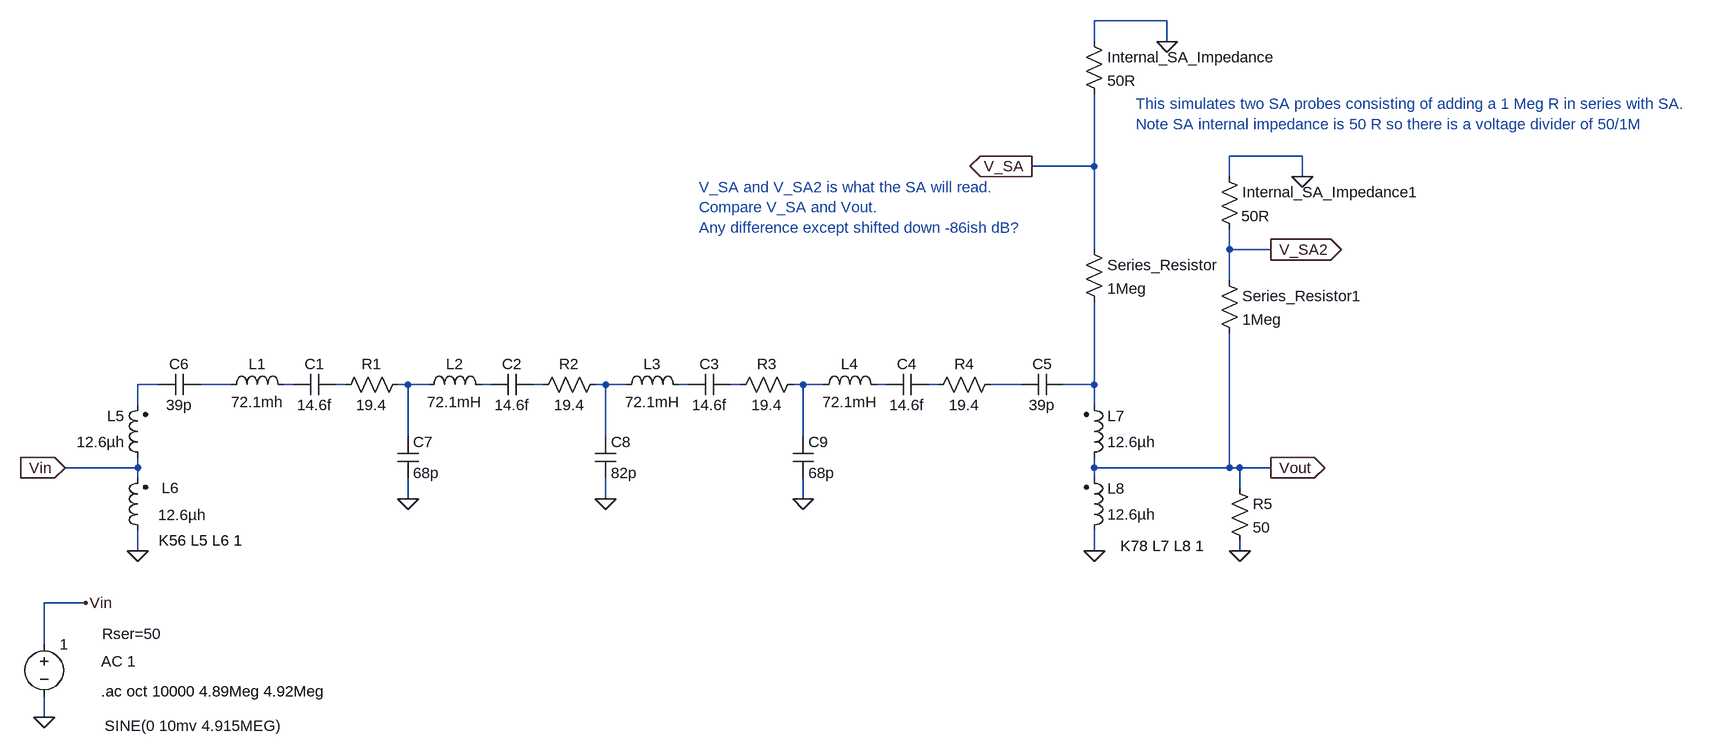
[diagram p0: schematic Crystal Filter with 1MR Probe Resistor.asc]
Crystal Filter with 1MR Probe Resistor.asc, the LTspice schematic file:
Version 4
SHEET 1 2812 680
WIRE 1456 -976 1344 -976
WIRE 1344 -944 1344 -976
WIRE 1456 -944 1456 -976
WIRE 1664 -768 1552 -768
WIRE 1344 -752 1344 -864
WIRE 1344 -752 1248 -752
WIRE 1552 -736 1552 -768
WIRE 1664 -736 1664 -768
WIRE 1344 -624 1344 -752
WIRE 1552 -624 1552 -656
WIRE 1616 -624 1552 -624
WIRE 1552 -576 1552 -624
WIRE -96 -416 -128 -416
WIRE 16 -416 -32 -416
WIRE 112 -416 96 -416
WIRE 192 -416 176 -416
WIRE 288 -416 272 -416
WIRE 320 -416 288 -416
WIRE 416 -416 400 -416
WIRE 496 -416 480 -416
WIRE 592 -416 576 -416
WIRE 624 -416 592 -416
WIRE 720 -416 704 -416
WIRE 800 -416 784 -416
WIRE 896 -416 880 -416
WIRE 928 -416 896 -416
WIRE 1024 -416 1008 -416
WIRE 1104 -416 1088 -416
WIRE 1232 -416 1184 -416
WIRE 1344 -416 1344 -544
WIRE 1344 -416 1296 -416
WIRE -128 -384 -128 -416
WIRE 1344 -384 1344 -416
WIRE 288 -336 288 -416
WIRE 592 -336 592 -416
WIRE 896 -336 896 -416
WIRE -128 -288 -128 -304
WIRE -128 -288 -240 -288
WIRE 1344 -288 1344 -304
WIRE 1552 -288 1552 -496
WIRE 1552 -288 1344 -288
WIRE 1568 -288 1552 -288
WIRE 1616 -288 1568 -288
WIRE -128 -272 -128 -288
WIRE 1344 -272 1344 -288
WIRE 1568 -256 1568 -288
WIRE 288 -240 288 -272
WIRE 592 -240 592 -272
WIRE 896 -240 896 -272
WIRE -128 -160 -128 -192
WIRE 1344 -160 1344 -192
WIRE 1568 -160 1568 -176
WIRE -208 -80 -272 -80
WIRE -272 -16 -272 -80
WIRE -272 96 -272 64
FLAG 896 -240 0
FLAG 592 -240 0
FLAG 288 -240 0
FLAG -272 96 0
FLAG -208 -80 Vin
FLAG -128 -160 0
FLAG 1344 -160 0
FLAG 1616 -288 Vout
IOPIN 1616 -288 Out
FLAG -240 -288 Vin
IOPIN -240 -288 In
FLAG 1568 -160 0
FLAG 1456 -944 0
FLAG 1664 -736 0
FLAG 1248 -752 V_SA
IOPIN 1248 -752 Out
FLAG 1616 -624 V_SA2
IOPIN 1616 -624 Out
SYMBOL ind 0 -400 R270
WINDOW 0 32 56 VTop 2
WINDOW 3 5 56 VBottom 2
SYMATTR InstName L1
SYMATTR Value 72.1mh
SYMBOL cap 176 -432 R90
WINDOW 0 0 32 VBottom 2
WINDOW 3 32 32 VTop 2
SYMATTR InstName C1
SYMATTR Value 14.6f
SYMBOL res 288 -432 R90
WINDOW 0 0 56 VBottom 2
WINDOW 3 32 56 VTop 2
SYMATTR InstName R1
SYMATTR Value 19.4
SYMBOL ind 304 -400 R270
WINDOW 0 32 56 VTop 2
WINDOW 3 5 56 VBottom 2
SYMATTR InstName L2
SYMATTR Value 72.1mH
SYMBOL cap 480 -432 R90
WINDOW 0 0 32 VBottom 2
WINDOW 3 32 32 VTop 2
SYMATTR InstName C2
SYMATTR Value 14.6f
SYMBOL res 592 -432 R90
WINDOW 0 0 56 VBottom 2
WINDOW 3 32 56 VTop 2
SYMATTR InstName R2
SYMATTR Value 19.4
SYMBOL ind 608 -400 R270
WINDOW 0 32 56 VTop 2
WINDOW 3 5 56 VBottom 2
SYMATTR InstName L3
SYMATTR Value 72.1mH
SYMBOL cap 784 -432 R90
WINDOW 0 0 32 VBottom 2
WINDOW 3 32 32 VTop 2
SYMATTR InstName C3
SYMATTR Value 14.6f
SYMBOL res 896 -432 R90
WINDOW 0 0 56 VBottom 2
WINDOW 3 32 56 VTop 2
SYMATTR InstName R3
SYMATTR Value 19.4
SYMBOL ind 912 -400 R270
WINDOW 0 32 56 VTop 2
WINDOW 3 5 56 VBottom 2
SYMATTR InstName L4
SYMATTR Value 72.1mH
SYMBOL cap 1088 -432 R90
WINDOW 0 0 32 VBottom 2
WINDOW 3 32 32 VTop 2
SYMATTR InstName C4
SYMATTR Value 14.6f
SYMBOL res 1200 -432 R90
WINDOW 0 0 56 VBottom 2
WINDOW 3 32 56 VTop 2
SYMATTR InstName R4
SYMATTR Value 19.4
SYMBOL cap 1232 -400 R270
WINDOW 0 32 32 VTop 2
WINDOW 3 0 32 VBottom 2
SYMATTR InstName C5
SYMATTR Value 39p
SYMBOL cap -96 -400 R270
WINDOW 0 32 32 VTop 2
WINDOW 3 0 32 VBottom 2
SYMATTR InstName C6
SYMATTR Value 39p
SYMBOL cap 272 -336 R0
SYMATTR InstName C7
SYMATTR Value 68p
SYMBOL cap 576 -336 R0
SYMATTR InstName C8
SYMATTR Value 82p
SYMBOL cap 880 -336 R0
SYMATTR InstName C9
SYMATTR Value 68p
SYMBOL voltage -272 -32 R0
WINDOW 123 88 42 Left 2
WINDOW 39 89 0 Left 2
WINDOW 3 93 141 Left 2
SYMATTR Value2 AC 1
SYMATTR SpiceLine Rser=50
SYMATTR Value SINE(0 10mv 4.915MEG)
SYMATTR InstName 1
SYMBOL ind2 -112 -288 R180
WINDOW 0 36 80 Left 2
WINDOW 3 36 40 Left 2
SYMATTR InstName L5
SYMATTR Value 12.6µh
SYMATTR Type ind
SYMBOL ind2 -112 -176 R180
WINDOW 0 -48 81 Left 2
WINDOW 3 -90 39 Left 2
SYMATTR InstName L6
SYMATTR Value 12.6µh
SYMATTR Type ind
SYMBOL ind2 1328 -288 M180
WINDOW 0 36 80 Left 2
WINDOW 3 36 40 Left 2
SYMATTR InstName L7
SYMATTR Value 12.6µh
SYMATTR Type ind
SYMBOL ind2 1328 -176 M180
WINDOW 0 36 80 Left 2
WINDOW 3 36 40 Left 2
SYMATTR InstName L8
SYMATTR Value 12.6µh
SYMATTR Type ind
SYMBOL res 1552 -272 R0
SYMATTR InstName R5
SYMATTR Value 50
SYMBOL res 1328 -640 R0
SYMATTR InstName Series_Resistor
SYMATTR Value 1Meg
SYMBOL res 1328 -960 R0
SYMATTR InstName Internal_SA_Impedance
SYMATTR Value 50R
SYMBOL res 1536 -592 R0
SYMATTR InstName Series_Resistor1
SYMATTR Value 1Meg
SYMBOL res 1536 -752 R0
WINDOW 3 34 77 Left 2
SYMATTR Value 50R
SYMATTR InstName Internal_SA_Impedance1
TEXT -96 -176 Left 2 !K56 L5 L6 1
TEXT 1384 -168 Left 2 !K78 L7 L8 1
TEXT -184 56 Left 2 !.ac oct 10000 4.89Meg 4.92Meg
TEXT 1408 -848 Left 2 ;This simulates two SA probes consisting of adding a 1 Meg R in series with SA. \nNote SA internal impedance is 50 R so there is a voltage divider of 50/1M
TEXT 736 -720 Left 2 ;V_SA and V_SA2 is what the SA will read.\nCompare V_SA and Vout.  \nAny difference except shifted down -86ish dB?

The netlist it stands for:
* Crystal Filter with 1MR Probe Resistor.asc
L1 N002 N003 72.1mh
C1 N004 N003 14.6f
R1 N005 N004 19.4
L2 N005 N006 72.1mH
C2 N007 N006 14.6f
R2 N008 N007 19.4
L3 N008 N009 72.1mH
C3 N010 N009 14.6f
R3 N011 N010 19.4
L4 N011 N012 72.1mH
C4 N013 N012 14.6f
R4 N014 N013 19.4
C5 N014 N015 39p
C6 N001 N002 39p
C7 N005 0 68p
C8 N008 0 82p
C9 N011 0 68p
V§1 Vin 0 SINE(0 10mv 4.915MEG) AC 1 Rser=50
L5 Vin N001 12.6µh
L6 0 Vin 12.6µh
L7 Vout N015 12.6µh
L8 0 Vout 12.6µh
R5 Vout 0 50
R§Series_Resistor V_SA N015 1Meg
R§Internal_SA_Impedance 0 V_SA 50R
R§Series_Resistor1 V_SA2 Vout 1Meg
R§Internal_SA_Impedance1 0 V_SA2 50R
K56 L5 L6 1
K78 L7 L8 1
.ac oct 10000 4.89Meg 4.92Meg
* This simulates two SA probes consisting of adding a 1 Meg R in series with SA.
* Note SA internal impedance is 50 R so there is a voltage divider of 50/1M
* V_SA and V_SA2 is what the SA will read.
* Compare V_SA and Vout.
* Any difference except shifted down -86ish dB?
.backanno
.end